# Altium schematic sheet MicroSD.SchDoc: MICRO-SD
size A4; DocumentNumber: 4; SheetNumber: 4; SheetTotal: 18
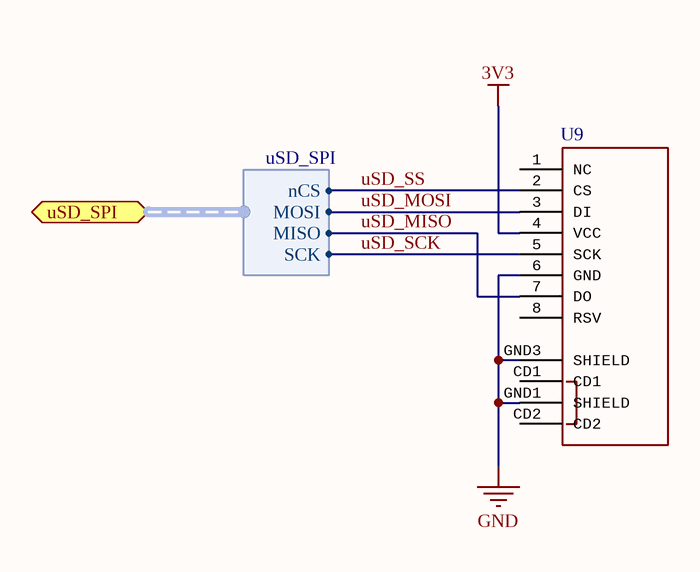
[diagram p0: MicroSD.SchDoc]

## Parts
U9  microSD Socket  [MICRO-SD-SOCKET-PP]  (value not drawn)

## Ports
uSD_SPI (harness uSD_SPI)

## Harnesses
uSD_SPI: nCS, MOSI, MISO, SCK

## Nets
3V3: U9.4(VCC)
GND: U9.6(GND) U9.GND1(SHIELD) U9.GND3(SHIELD)
uSD_MISO: U9.7(DO) ; port uSD_SPI.MISO
uSD_MOSI: U9.3(DI) ; port uSD_SPI.MOSI
uSD_SCK: U9.5(SCK) ; port uSD_SPI.SCK
uSD_SS: U9.2(CS) ; port uSD_SPI.nCS

Not connected (* = marked no-connect by the designer): U9 1(NC) 8(RSV) CD1 CD2

## Notes on the sheet
- Title
- Size:
- Date:
- A4
- Number:
- Time:
- Revision:
- Sheet
- of
- File:

## Library data of the parts
U9 = USD-SOCKETNEW: microSD Socket, Push-push type. Schematic element and footprint production proven. Spark Fun Electronics SKU : PRT-00127. tDoc lines correctly indicate media card edge positions when inserting (unlocked, locked, depressed). NOTE: CD1 and CD2 are connected internally; PROD_ID: CONN-07820